# Altium project Serve.my-pi.PrjPcb
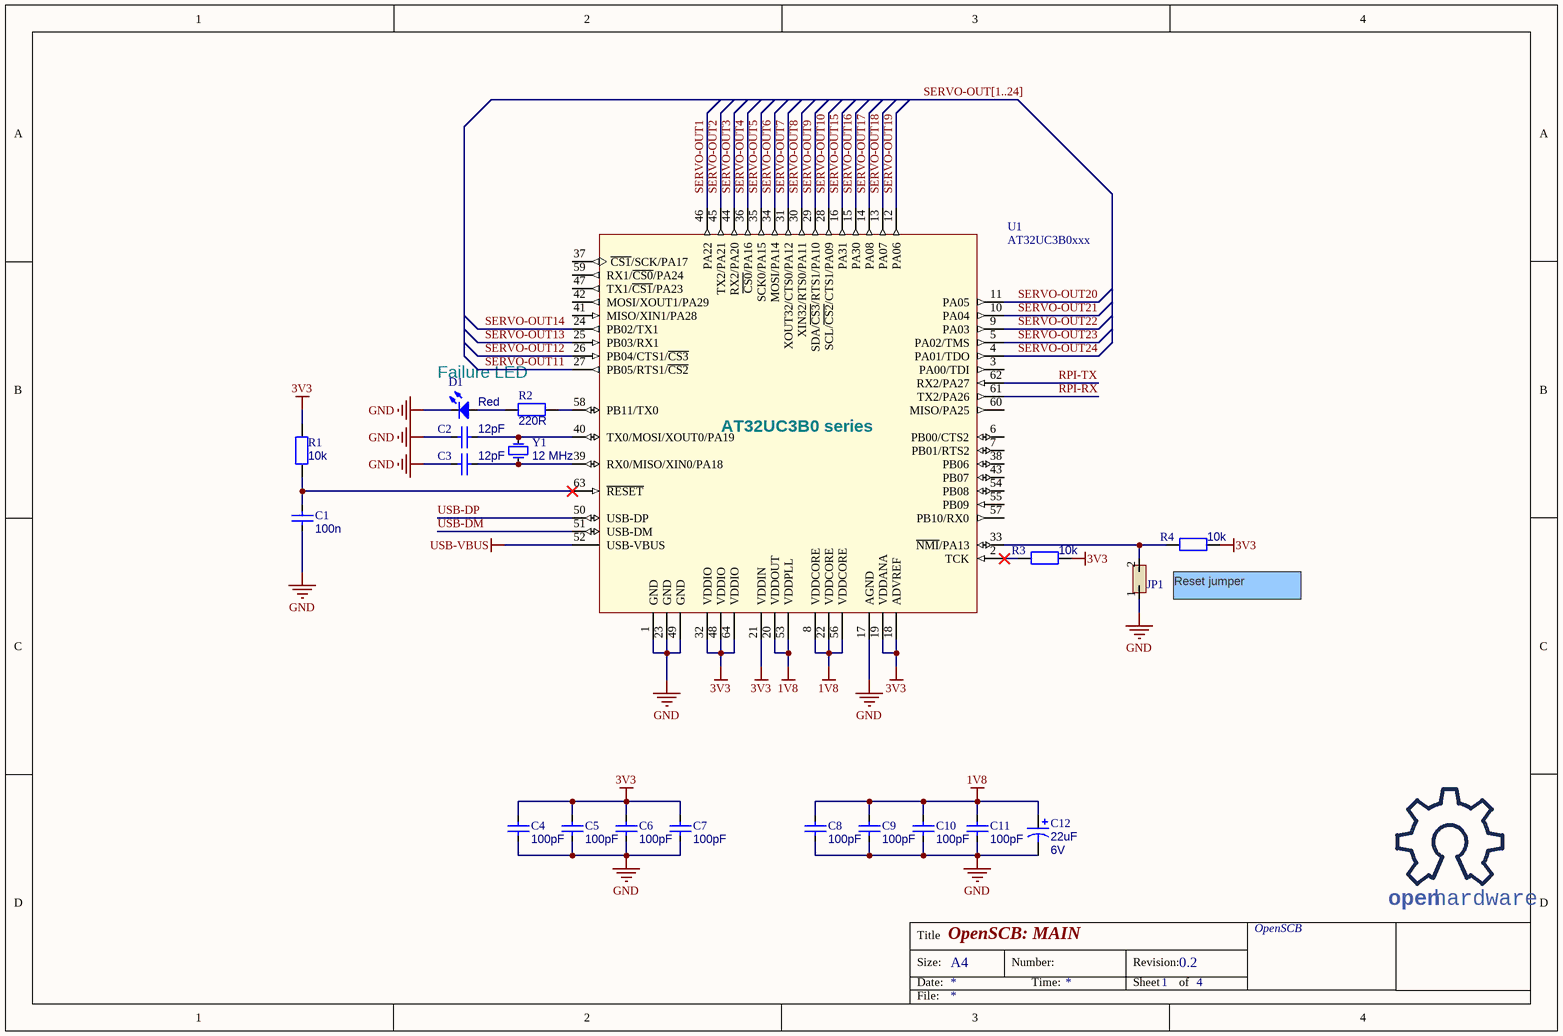
[diagram p0: Main.SchDoc]
Title: RC-Expander
4 sheets, 88 parts. Net scope: global (net labels, ports and power ports of the same name join across sheets).
Board file: Serve.my-pi.PcbDoc
Sheets:
  Main.SchDoc
  SERVO-Outputs.SchDoc
  Power.SchDoc
  Com.SchDoc

## Sheet Main.SchDoc: OpenSCB: MAIN
size A4; Organization: OpenSCB; Revision: 0.2; SheetNumber: 1; SheetTotal: 4

### Parts
*1  OSHW  [OSHW]  (value not drawn)
C1  value 100n  [CC1005-0402]  (hidden comment: Condensateur)
C2  value 12pF  [CC1005-0402]  (hidden comment: Condensateur)
C3  value 12pF  [CC1005-0402]  (hidden comment: Condensateur)
C4  value 100pF  [CC1005-0402]  (hidden comment: Condensateur)
C5  value 100pF  [CC1005-0402]  (hidden comment: Condensateur)
C6  value 100pF  [CC1005-0402]  (hidden comment: Condensateur)
C7  value 100pF  [CC1005-0402]  (hidden comment: Condensateur)
C8  value 100pF  [CC1005-0402]  (hidden comment: Condensateur)
C9  value 100pF  [CC1005-0402]  (hidden comment: Condensateur)
C10  value 100pF  [CC1005-0402]  (hidden comment: Condensateur)
C11  value 100pF  [CC1005-0402]  (hidden comment: Condensateur)
C12  value 22uF  Voltage: 6V  [TC3216-1206]  (hidden comment: Condensateur Polarise)
D1  Color: Red  [DIODE-0603]  (hidden comment: Led)
JP1  Jumper  [HDR1X2]  (value not drawn)
R1  value 10k  [CR1005-0402]  (hidden comment: Resistance)
R2  value 220R  [CR1005-0402]  (hidden comment: Resistance)
R3  value 10k  [CR1005-0402]  (hidden comment: Resistance)
R4  value 10k  [CR1005-0402]  (hidden comment: Resistance)
U1  AT32UC3B0xxx  [TSQFP50P1200X1200-64N]
Y1  value 12 MHz  [7B]  (hidden comment: Quartz)

### Nets
1V8: C8.2 C9.2 C10.2 C11.2 C12.1 U1.8(VDDCORE) U1.20(VDDOUT) U1.22(VDDCORE) U1.53(VDDPLL) U1.56(VDDCORE)
3V3: C4.2 C5.2 C6.2 C7.2 R1.2 R3.2 R4.2 U1.18(ADVREF) U1.19(VDDANA) U1.21(VDDIN) U1.32(VDDIO) U1.48(VDDIO) U1.64(VDDIO)
GND: C1.1 C2.1 C3.2 C4.1 C5.1 C6.1 C7.1 C8.1 C9.1 C10.1 C11.1 C12.2 D1.2(K) JP1.1 U1.1(GND) U1.17(AGND) U1.23(GND) U1.49(GND)
USB-VBUS: U1.52(USB-VBUS)
RPI-RX: U1.61(TX2/PA26)
RPI-TX: U1.62(RX2/PA27)
SERVO-OUT1: U1.46(PA22)
SERVO-OUT2: U1.45(TX2/PA21)
SERVO-OUT3: U1.44(RX2/PA20)
SERVO-OUT4: U1.36(~{CS0}/PA16)
SERVO-OUT5: U1.35(SCK0/PA15)
SERVO-OUT6: U1.34(MOSI/PA14)
SERVO-OUT7: U1.31(XOUT32/CTS0/PA12)
SERVO-OUT8: U1.30(XIN32/RTS0/PA11)
SERVO-OUT9: U1.29(SDA/~{CS3}/RTS1/PA10)
SERVO-OUT10: U1.28(SCL/~{CS2}/CTS1/PA09)
SERVO-OUT11: U1.27(PB05/RTS1/~{CS2})
SERVO-OUT12: U1.26(PB04/CTS1/~{CS3})
SERVO-OUT13: U1.25(PB03/RX1)
SERVO-OUT14: U1.24(PB02/TX1)
SERVO-OUT15: U1.16(PA31)
SERVO-OUT16: U1.15(PA30)
SERVO-OUT17: U1.14(PA08)
SERVO-OUT18: U1.13(PA07)
SERVO-OUT19: U1.12(PA06)
SERVO-OUT20: U1.11(PA05)
SERVO-OUT21: U1.10(PA04)
SERVO-OUT22: U1.9(PA03)
SERVO-OUT23: U1.5(PA02/TMS)
SERVO-OUT24: U1.4(PA01/TDO)
USB-DM: U1.51(USB-DM)
USB-DP: U1.50(USB-DP)
NetC1_2: C1.2 R1.1 U1.63(~{RESET})
NetC2_2: C2.2 U1.40(TX0/MOSI/XOUT0/PA19) Y1.2(OSC2)
NetC3_1: C3.1 U1.39(RX0/MISO/XIN0/PA18) Y1.1(OSC1)
NetD1_1: D1.1(A) R2.2
NetJP1_2: JP1.2 R4.1 U1.33(~{NMI}/PA13)
NetR2_1: R2.1 U1.58(PB11/TX0)
NetR3_1: R3.1 U1.2(TCK)

Not connected (* = marked no-connect by the designer): U1 3(PA00/TDI) 6(PB00/CTS2) 7(PB01/RTS2) 37(~{CS1}/SCK/PA17) 38(PB06) 41(MISO/XIN1/PA28) 42(MOSI/XOUT1/PA29) 43(PB07) 47(TX1/~{CS1}/PA23) 54(PB08) 55(PB09) 57(PB10/RX0) 59(RX1/~{CS0}/PA24) 60(MISO/PA25)

### Buses and harness runs
bus SERVO-OUT[1..24]

### Notes on the sheet
- (near D1) Failure LED
- Reset jumper
- Title
- Size:
- Date:
- A4
- Number:
- Time:
- Revision:
- Sheet
- of
- File:
- (in symbol AT32UC3B0xxx) AT32UC3B0 series
- (in symbol OSHW) open; hardware

### Library data of the parts
*1 = OSHW: Open Hardware logo
JP1 = Jumper: Header 2 pts
R1-R4 = Resistance: Precision: 5%; Power: 0.5W
U1 = AT32UC3B0xxx: AVR32 32-Bit Microcontroller
Y1 = Quartz: SMD Crystal oscillator; Precision: 20ppm
C1-C11 = Condensateur: Revision: July-2002: Re-released for DXP Platform.
C12 = Condensateur Polarise: Published: 8-Jun-2000; Revision: July-2002: Re-released for DXP Platform.; Publisher: Altium Limited

## Sheet SERVO-Outputs.SchDoc: OpenSCB: SERVO Outputs
size A4; Organization: OpenSCB; Revision: 0.2; SheetNumber: 2; SheetTotal: 4
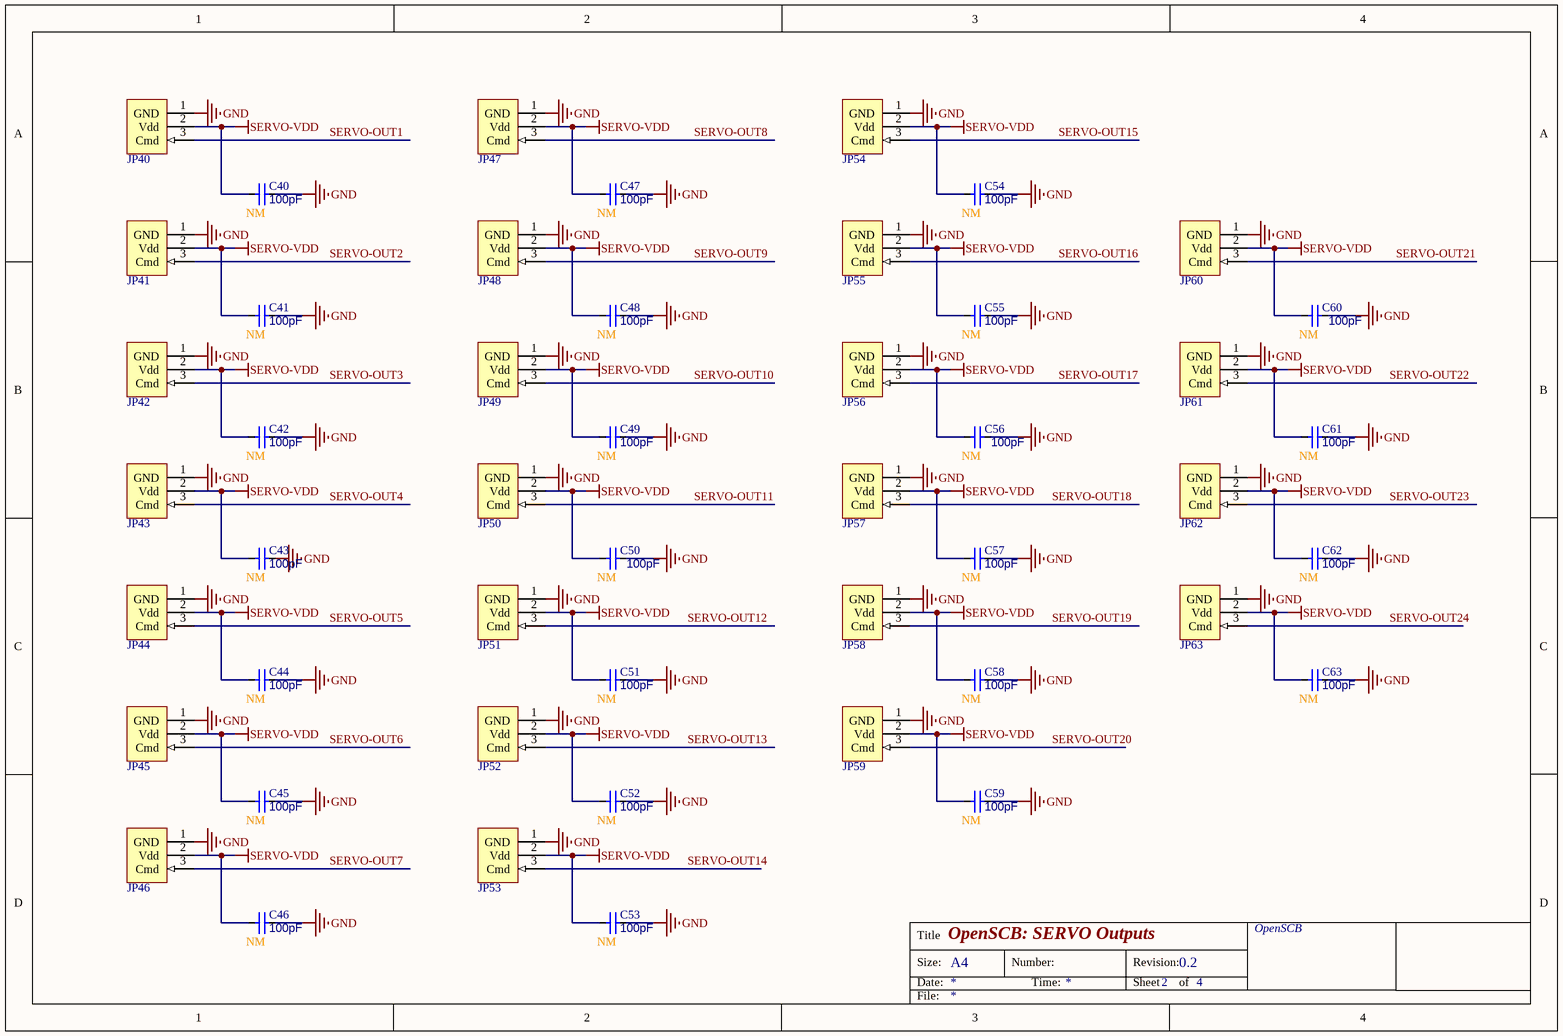
[diagram p1: SERVO-Outputs.SchDoc]

### Parts
C40  value 100pF  [CC1005-0402]  (hidden comment: Condensateur)
C41  value 100pF  [CC1005-0402]  (hidden comment: Condensateur)
C42  value 100pF  [CC1005-0402]  (hidden comment: Condensateur)
C43  value 100pF  [CC1005-0402]  (hidden comment: Condensateur)
C44  value 100pF  [CC1005-0402]  (hidden comment: Condensateur)
C45  value 100pF  [CC1005-0402]  (hidden comment: Condensateur)
C46  value 100pF  [CC1005-0402]  (hidden comment: Condensateur)
C47  value 100pF  [CC1005-0402]  (hidden comment: Condensateur)
C48  value 100pF  [CC1005-0402]  (hidden comment: Condensateur)
C49  value 100pF  [CC1005-0402]  (hidden comment: Condensateur)
C50  value 100pF  [CC1005-0402]  (hidden comment: Condensateur)
C51  value 100pF  [CC1005-0402]  (hidden comment: Condensateur)
C52  value 100pF  [CC1005-0402]  (hidden comment: Condensateur)
C53  value 100pF  [CC1005-0402]  (hidden comment: Condensateur)
C54  value 100pF  [CC1005-0402]  (hidden comment: Condensateur)
C55  value 100pF  [CC1005-0402]  (hidden comment: Condensateur)
C56  value 100pF  [CC1005-0402]  (hidden comment: Condensateur)
C57  value 100pF  [CC1005-0402]  (hidden comment: Condensateur)
C58  value 100pF  [CC1005-0402]  (hidden comment: Condensateur)
C59  value 100pF  [CC1005-0402]  (hidden comment: Condensateur)
C60  value 100pF  [CC1005-0402]  (hidden comment: Condensateur)
C61  value 100pF  [CC1005-0402]  (hidden comment: Condensateur)
C62  value 100pF  [CC1005-0402]  (hidden comment: Condensateur)
C63  value 100pF  [CC1005-0402]  (hidden comment: Condensateur)
JP40  SERVO Connector  [PinHead-3pts]  (value not drawn)
JP41  SERVO Connector  [PinHead-3pts]  (value not drawn)
JP42  SERVO Connector  [PinHead-3pts]  (value not drawn)
JP43  SERVO Connector  [PinHead-3pts]  (value not drawn)
JP44  SERVO Connector  [PinHead-3pts]  (value not drawn)
JP45  SERVO Connector  [PinHead-3pts]  (value not drawn)
JP46  SERVO Connector  [PinHead-3pts]  (value not drawn)
JP47  SERVO Connector  [PinHead-3pts]  (value not drawn)
JP48  SERVO Connector  [PinHead-3pts]  (value not drawn)
JP49  SERVO Connector  [PinHead-3pts]  (value not drawn)
JP50  SERVO Connector  [PinHead-3pts]  (value not drawn)
JP51  SERVO Connector  [PinHead-3pts]  (value not drawn)
JP52  SERVO Connector  [PinHead-3pts]  (value not drawn)
JP53  SERVO Connector  [PinHead-3pts]  (value not drawn)
JP54  SERVO Connector  [PinHead-3pts]  (value not drawn)
JP55  SERVO Connector  [PinHead-3pts]  (value not drawn)
JP56  SERVO Connector  [PinHead-3pts]  (value not drawn)
JP57  SERVO Connector  [PinHead-3pts]  (value not drawn)
JP58  SERVO Connector  [PinHead-3pts]  (value not drawn)
JP59  SERVO Connector  [PinHead-3pts]  (value not drawn)
JP60  SERVO Connector  [PinHead-3pts]  (value not drawn)
JP61  SERVO Connector  [PinHead-3pts]  (value not drawn)
JP62  SERVO Connector  [PinHead-3pts]  (value not drawn)
JP63  SERVO Connector  [PinHead-3pts]  (value not drawn)

### Nets
GND: C40.1 C41.1 C42.1 C43.1 C44.1 C45.1 C46.1 C47.1 C48.1 C49.1 C50.1 C51.1 C52.1 C53.1 C54.1 C55.1 C56.1 C57.1 C58.1 C59.1 C60.1 C61.1 C62.1 C63.1 JP40.1(GND) JP41.1(GND) JP42.1(GND) JP43.1(GND) JP44.1(GND) JP45.1(GND) JP46.1(GND) JP47.1(GND) JP48.1(GND) JP49.1(GND) JP50.1(GND) JP51.1(GND) JP52.1(GND) JP53.1(GND) JP54.1(GND) JP55.1(GND) JP56.1(GND) JP57.1(GND) JP58.1(GND) JP59.1(GND) JP60.1(GND) JP61.1(GND) JP62.1(GND) JP63.1(GND)
SERVO-VDD: C40.2 C41.2 C42.2 C43.2 C44.2 C45.2 C46.2 C47.2 C48.2 C49.2 C50.2 C51.2 C52.2 C53.2 C54.2 C55.2 C56.2 C57.2 C58.2 C59.2 C60.2 C61.2 C62.2 C63.2 JP40.2(Vdd) JP41.2(Vdd) JP42.2(Vdd) JP43.2(Vdd) JP44.2(Vdd) JP45.2(Vdd) JP46.2(Vdd) JP47.2(Vdd) JP48.2(Vdd) JP49.2(Vdd) JP50.2(Vdd) JP51.2(Vdd) JP52.2(Vdd) JP53.2(Vdd) JP54.2(Vdd) JP55.2(Vdd) JP56.2(Vdd) JP57.2(Vdd) JP58.2(Vdd) JP59.2(Vdd) JP60.2(Vdd) JP61.2(Vdd) JP62.2(Vdd) JP63.2(Vdd)
SERVO-OUT1: JP40.3(Cmd)
SERVO-OUT2: JP41.3(Cmd)
SERVO-OUT3: JP42.3(Cmd)
SERVO-OUT4: JP43.3(Cmd)
SERVO-OUT5: JP44.3(Cmd)
SERVO-OUT6: JP45.3(Cmd)
SERVO-OUT7: JP46.3(Cmd)
SERVO-OUT8: JP47.3(Cmd)
SERVO-OUT9: JP48.3(Cmd)
SERVO-OUT10: JP49.3(Cmd)
SERVO-OUT11: JP50.3(Cmd)
SERVO-OUT12: JP51.3(Cmd)
SERVO-OUT13: JP52.3(Cmd)
SERVO-OUT14: JP53.3(Cmd)
SERVO-OUT15: JP54.3(Cmd)
SERVO-OUT16: JP55.3(Cmd)
SERVO-OUT17: JP56.3(Cmd)
SERVO-OUT18: JP57.3(Cmd)
SERVO-OUT19: JP58.3(Cmd)
SERVO-OUT20: JP59.3(Cmd)
SERVO-OUT21: JP60.3(Cmd)
SERVO-OUT22: JP61.3(Cmd)
SERVO-OUT23: JP62.3(Cmd)
SERVO-OUT24: JP63.3(Cmd)

### Notes on the sheet
- Title
- Size:
- Date:
- A4
- Number:
- Time:
- Revision:
- Sheet
- of
- File:

### Library data of the parts
JP40-JP63 = SERVO-Connector
C40-C63 = Condensateur: Revision: July-2002: Re-released for DXP Platform.; NM: NM

## Sheet Power.SchDoc: OpenSCB: POWER
size A4; Organization: OpenSCB; Revision: 0.2; SheetNumber: 3; SheetTotal: 4
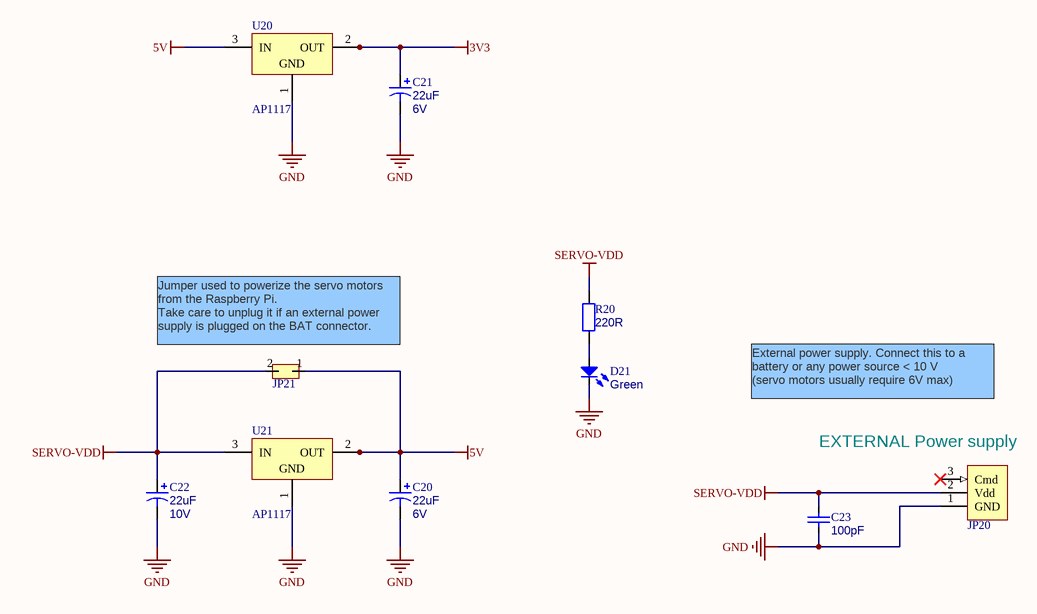
[diagram p2: Power.SchDoc]

### Parts
C20  value 22uF  Voltage: 6V  [TC3216-1206]  (hidden comment: Condensateur Polarise)
C21  value 22uF  Voltage: 6V  [TC3216-1206]  (hidden comment: Condensateur Polarise)
C22  value 22uF  Voltage: 10V  [TC3216-1206]  (hidden comment: Condensateur Polarise)
C23  value 100pF  [CC1005-0402]  (hidden comment: Condensateur)
D21  Color: Green  [DIODE-0603]  (hidden comment: Led)
JP20  SERVO Connector  [PinHead-3pts]  (value not drawn)
JP21  Jumper  [HDR1X2]  (value not drawn)
R20  value 220R  [CR1005-0402]  (hidden comment: Resistance)
U20  AP1117  [SOT-89]
U21  AP1117  [SOT-89]

### Nets
3V3: C21.1 U20.0(OUT) U20.2(OUT)
5V: C20.1 JP21.1 U20.3(IN) U21.0(OUT) U21.2(OUT)
GND: C20.2 C21.2 C22.2 C23.1 D21.2(K) JP20.1(GND) U20.1(GND) U21.1(GND)
SERVO-VDD: C22.1 C23.2 JP20.2(Vdd) JP21.2 R20.2 U21.3(IN)
NetD21_1: D21.1(A) R20.1

Not connected (* = marked no-connect by the designer): JP20 3(Cmd)*

### Notes on the sheet
- (near JP21) Jumper used to powerize the servo motors from the Raspberry Pi.
  Take care to unplug it if an external power supply is plugged on the BAT connector.
- External power supply. Connect this to a battery or any power source < 10 V
  (servo motors usually require 6V max)
- (near JP20) EXTERNAL Power supply
- Title
- Size:
- Date:
- A4
- Number:
- Time:
- Revision:
- Sheet
- of
- File:

### Library data of the parts
JP20 = SERVO-Connector
JP21 = Jumper: Header 2 pts
R20 = Resistance: Precision: 5%; Power: 0.5W
U20 U21 = AP1117: AP1117 - 3V3 Voltage Regulator; Supplier Ref: 1825297; Supplier: Farnell
C20-C22 = Condensateur Polarise: Published: 8-Jun-2000; Revision: July-2002: Re-released for DXP Platform.; Publisher: Altium Limited
C23 = Condensateur: Revision: July-2002: Re-released for DXP Platform.

## Sheet Com.SchDoc: OpenSCB: COM
size A4; Organization: OpenSCB; Revision: 0.2; SheetNumber: 4; SheetTotal: 4
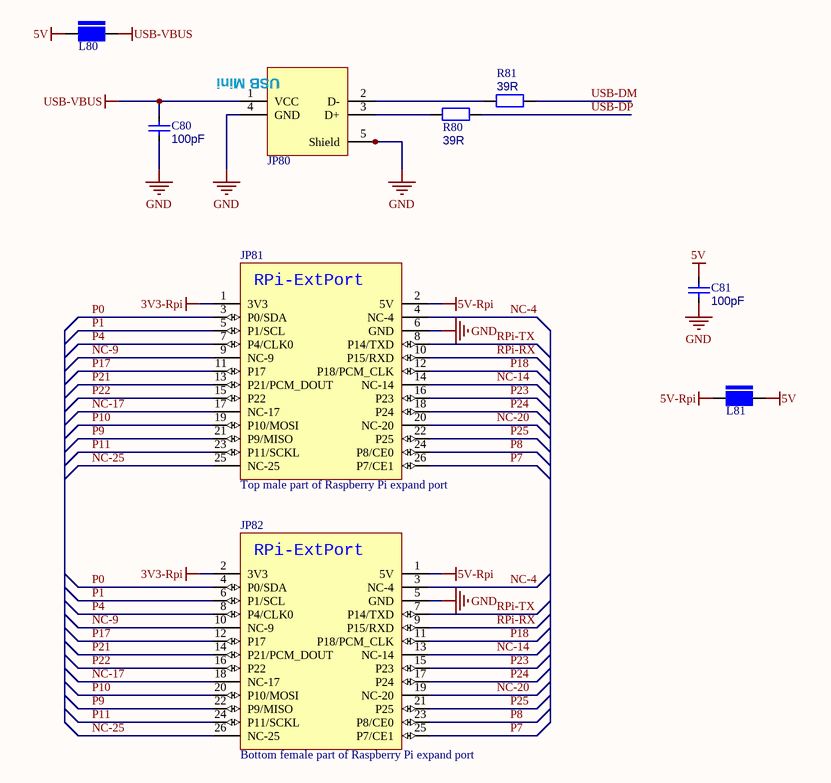
[diagram p3: Com.SchDoc]

### Parts
C80  value 100pF  [CC1005-0402]  (hidden comment: Condensateur)
C81  value 100pF  [CC1005-0402]  (hidden comment: Condensateur)
JP80  USB Mini-B SMD  [UX60SC-MB-5ST]  (value not drawn)
JP81  Top male part of Raspberry Pi expand port  [2x13 pins SMT male header]
JP82  Bottom female part of Raspberry Pi expand port  [2x13 pins SMT female header]
L80  Ferrite  [CR1608-0603]  (value not drawn)
L81  Ferrite  [CR1608-0603]  (value not drawn)
R80  value 39R  [CR1005-0402]  (hidden comment: Resistance)
R81  value 39R  [CR1005-0402]  (hidden comment: Resistance)

### Nets
3V3-Rpi: JP81.1(3V3) JP82.2(3V3)
5V: C81.2 L80.1 L81.2
5V-Rpi: JP81.2(5V) JP82.1(5V) L81.1
GND: C80.1 C81.1 JP80.4(GND) JP80.5(Shield) JP80.6(Shield) JP80.7(Shield) JP81.6(GND) JP82.5(GND)
USB-VBUS: C80.2 JP80.1(VCC) L80.2
NC-4: JP81.4(NC-4) JP82.3(NC-4)
NC-9: JP81.9(NC-9) JP82.10(NC-9)
NC-14: JP81.14(NC-14) JP82.13(NC-14)
NC-17: JP81.17(NC-17) JP82.18(NC-17)
NC-20: JP81.20(NC-20) JP82.19(NC-20)
NC-25: JP81.25(NC-25) JP82.26(NC-25)
P0: JP81.3(P0/SDA) JP82.4(P0/SDA)
P1: JP81.5(P1/SCL) JP82.6(P1/SCL)
P4: JP81.7(P4/CLK0) JP82.8(P4/CLK0)
P7: JP81.26(P7/CE1) JP82.25(P7/CE1)
P8: JP81.24(P8/CE0) JP82.23(P8/CE0)
P9: JP81.21(P9/MISO) JP82.22(P9/MISO)
P10: JP81.19(P10/MOSI) JP82.20(P10/MOSI)
P11: JP81.23(P11/SCKL) JP82.24(P11/SCKL)
P17: JP81.11(P17) JP82.12(P17)
P18: JP81.12(P18/PCM_CLK) JP82.11(P18/PCM_CLK)
P21: JP81.13(P21/PCM_DOUT) JP82.14(P21/PCM_DOUT)
P22: JP81.15(P22) JP82.16(P22)
P23: JP81.16(P23) JP82.15(P23)
P24: JP81.18(P24) JP82.17(P24)
P25: JP81.22(P25) JP82.21(P25)
RPI-RX: JP81.10(P15/RXD) JP82.9(P15/RXD)
RPI-TX: JP81.8(P14/TXD) JP82.7(P14/TXD)
USB-DM: R81.2
USB-DP: R80.2
NetJP80_2: JP80.2(D-) R81.1
NetJP80_3: JP80.3(D+) R80.1

### Notes on the sheet
- Title
- Size:
- Date:
- A4
- Number:
- Time:
- Revision:
- Sheet
- of
- File:
- (in symbol RPi-ExtPort-Bottom) RPi-ExtPort
- (in symbol RPi-ExtPort-Top) RPi-ExtPort
- (in symbol USB Mini-B SMD) USB Mini

### Library data of the parts
JP80 = USB Mini-B SMD: USB Mini, Type B, SMD
JP81 = RPi-ExtPort-Top
JP82 = RPi-ExtPort-Bottom
L80 L81 = Ferrite: Ferrite CMS
R80 R81 = Resistance: Precision: 5%; Power: 0.5W
C80 C81 = Condensateur: Revision: July-2002: Re-released for DXP Platform.

## Nets that join several sheets
3V3: Main (13 pins), Power (C21.1 U20.0 U20.2)
5V: Power (5 pins), Com (C81.2 L80.1 L81.2)
GND: Main (18 pins), SERVO-Outputs (48 pins), Power (8 pins), Com (8 pins)
SERVO-VDD: SERVO-Outputs (48 pins), Power (6 pins)
USB-VBUS: Main (U1.52), Com (C80.2 JP80.1 L80.2)
RPI-RX: Main (U1.61), Com (JP81.10 JP82.9)
RPI-TX: Main (U1.62), Com (JP81.8 JP82.7)
SERVO-OUT1: Main (U1.46), SERVO-Outputs (JP40.3)
SERVO-OUT2: Main (U1.45), SERVO-Outputs (JP41.3)
SERVO-OUT3: Main (U1.44), SERVO-Outputs (JP42.3)
SERVO-OUT4: Main (U1.36), SERVO-Outputs (JP43.3)
SERVO-OUT5: Main (U1.35), SERVO-Outputs (JP44.3)
SERVO-OUT6: Main (U1.34), SERVO-Outputs (JP45.3)
SERVO-OUT7: Main (U1.31), SERVO-Outputs (JP46.3)
SERVO-OUT8: Main (U1.30), SERVO-Outputs (JP47.3)
SERVO-OUT9: Main (U1.29), SERVO-Outputs (JP48.3)
SERVO-OUT10: Main (U1.28), SERVO-Outputs (JP49.3)
SERVO-OUT11: Main (U1.27), SERVO-Outputs (JP50.3)
SERVO-OUT12: Main (U1.26), SERVO-Outputs (JP51.3)
SERVO-OUT13: Main (U1.25), SERVO-Outputs (JP52.3)
SERVO-OUT14: Main (U1.24), SERVO-Outputs (JP53.3)
SERVO-OUT15: Main (U1.16), SERVO-Outputs (JP54.3)
SERVO-OUT16: Main (U1.15), SERVO-Outputs (JP55.3)
SERVO-OUT17: Main (U1.14), SERVO-Outputs (JP56.3)
SERVO-OUT18: Main (U1.13), SERVO-Outputs (JP57.3)
SERVO-OUT19: Main (U1.12), SERVO-Outputs (JP58.3)
SERVO-OUT20: Main (U1.11), SERVO-Outputs (JP59.3)
SERVO-OUT21: Main (U1.10), SERVO-Outputs (JP60.3)
SERVO-OUT22: Main (U1.9), SERVO-Outputs (JP61.3)
SERVO-OUT23: Main (U1.5), SERVO-Outputs (JP62.3)
SERVO-OUT24: Main (U1.4), SERVO-Outputs (JP63.3)
USB-DM: Main (U1.51), Com (R81.2)
USB-DP: Main (U1.50), Com (R80.2)